# EAGLE design usbx-001 (EAGLE 9.6.2)
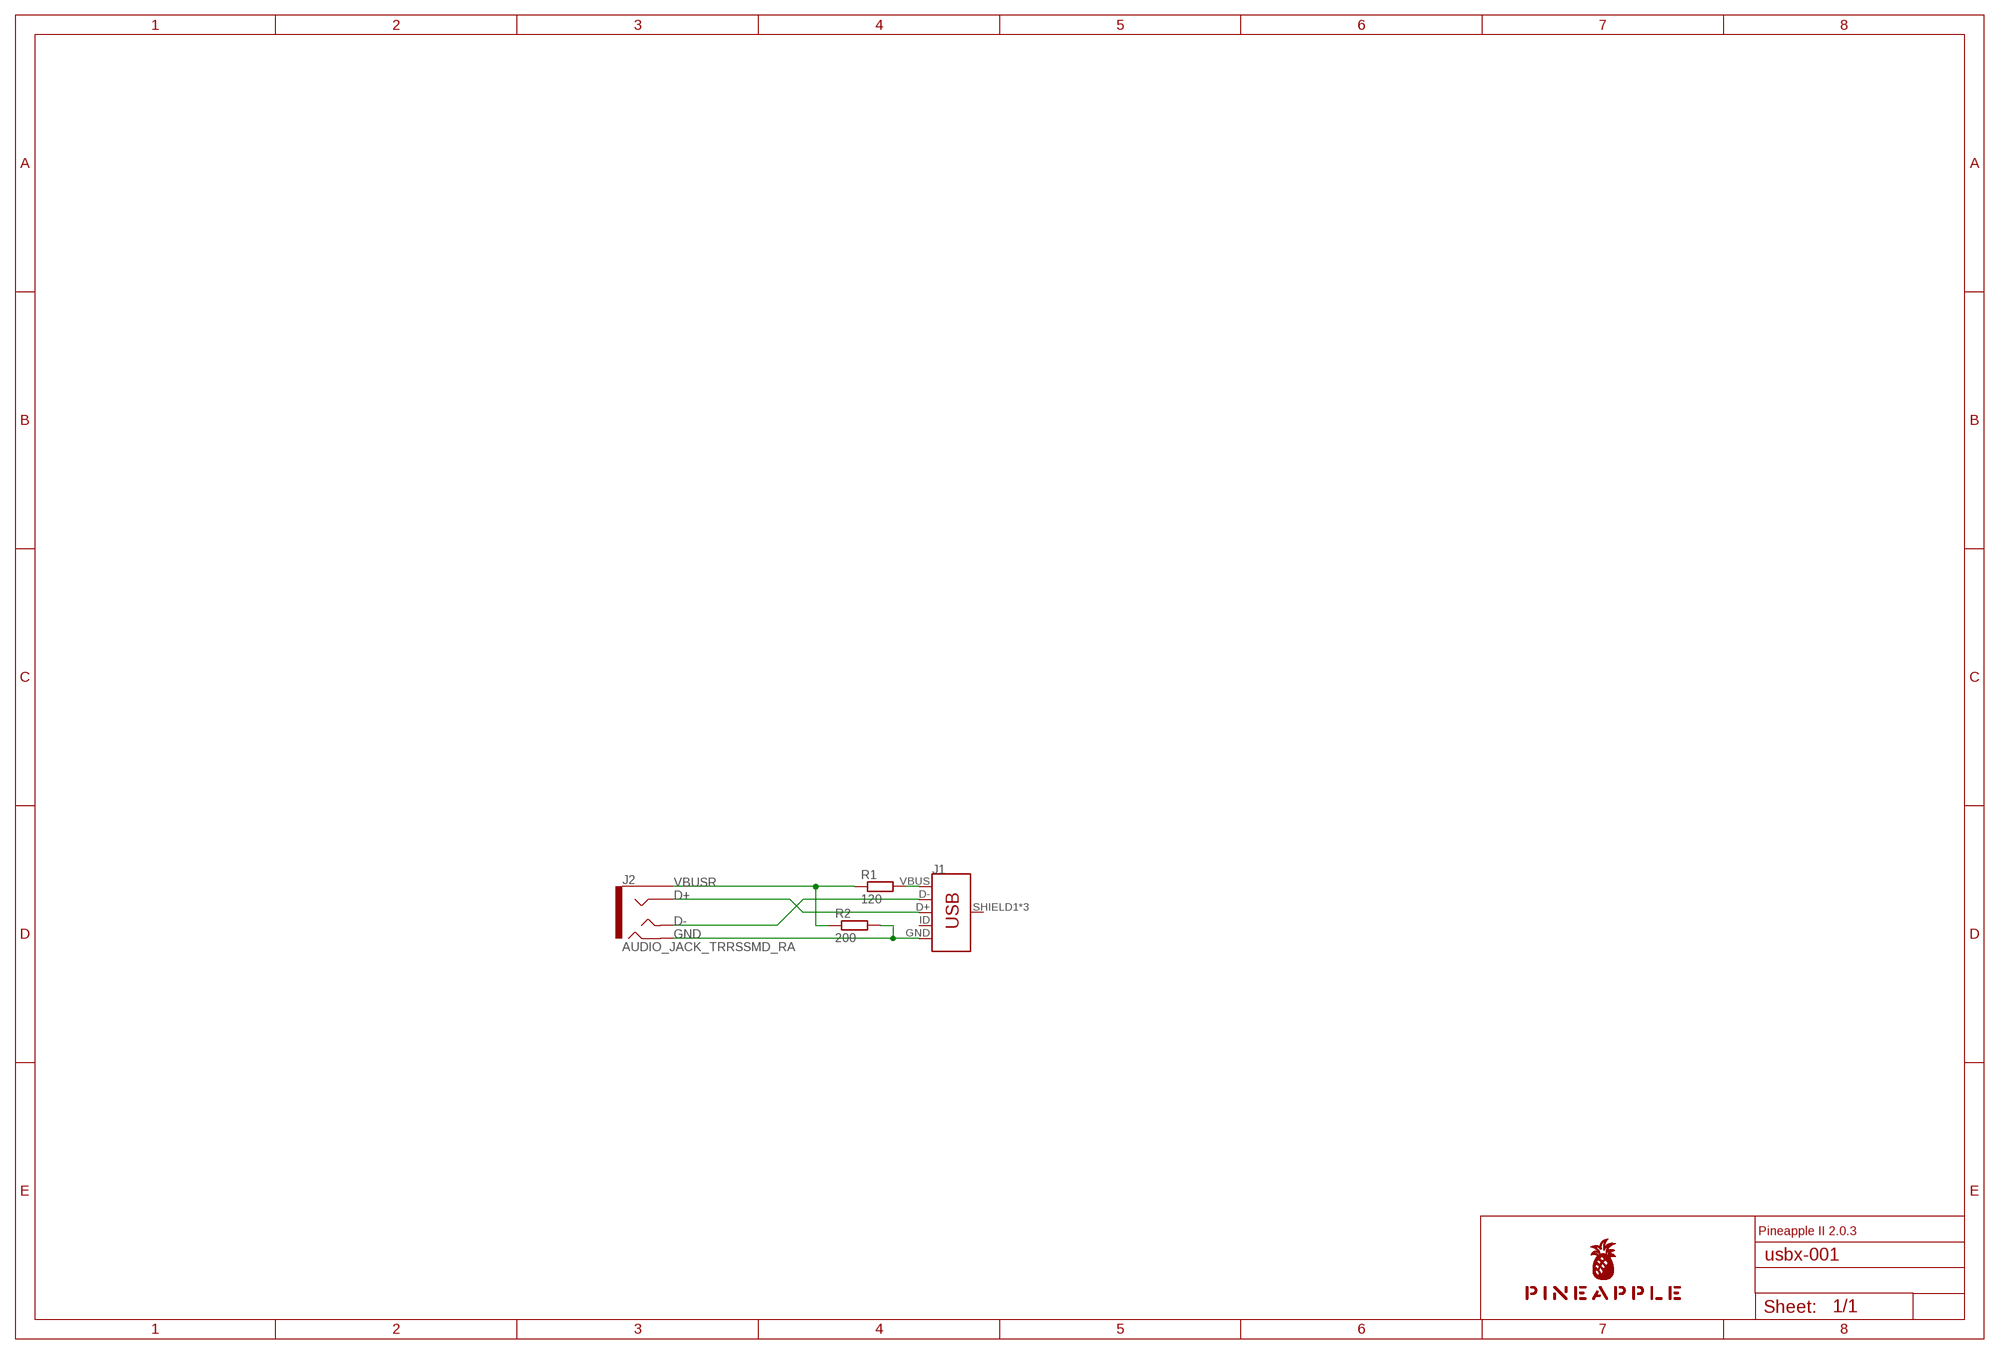
[diagram p0: schematic, sheet 1]

## Parts
J1  USB_MICRO-B_FEMALE-SMT  [USB-B-MICRO-SMD]
J2  AUDIO_JACK_TRRSSMD_RA  [AUDIO_JACK_3.5MM_TRRS_SMD_RA]
R1  120  R-EU_R2012  [R2012]
R2  200  R-EU_R2012  [R2012]
U$1  PINEAPPLE450_SILK  [PINEAPPLE450_SILK]

## Nets
D+: J1.D+ J2.RING1
D-: J1.D- J2.TIP
GND [gnd]: J1.GND J2.RING2 R2.2
VBUS [power]: J1.VBUS R1.2
VBUSR [power]: J2.EARTH R1.1 R2.1
Unconnected: J1.ID J1.SHIELD1(SHIELD) J1.SHIELD2(SHIELD) J1.SHIELD3(SHIELD)

## Notes on the sheet
- Pineapple II 2.0.3

## Library data of the parts
J1 = SparkFun-Connectors:USB_MICRO-B: USB Type Micro-B Connector Male/female and PTH/SMT variants SparkFun Products: SparkFun microB USB Breakout <https://www.sparkfun.com/products/12035> SparkFun USB microB Plug Breakout <https://www.sparkfun.com/products/10031> SparkFun ESP8266 Thing <https://www.sparkfun.com/products/13231>; PROD_ID: CONN-11752
J2 = SparkFun-Connectors:AUDIO_JACK_TRRS: Audio Jack - 3.5mm TRRS (SMD) This is a 3.5mm TRRS SMD audio jack. TRRS connectors are the audio-style connectors that you see on some phones, MP3 players and development boards. TRRS stands for “tip, ring, ring, sleeve,” which reflects that this has three conductors and a ground. SparkFun Products: Audio Jack <https://www.sparkfun.com/products/12639> mbed Starter Kit <https://www.sparkfun.com/products/12968> SparkFun TRRS 3.5mm Jack Breakout <https://www.sparkfun.com/products/11570>; PROD_ID: CONN-10676; SF_ID: PRT-12639
R1 R2 = rcl:R-EU_: RESISTOR, European symbol; SPICEPREFIX: R
U$1 = pineapple:PINEAPPLE450_SILK

## Net classes
0 default: width 0.152 mm, drill 0.152 mm, clearance 0.152 mm
1 gnd: width 0.305 mm, drill 0.152 mm, clearance 0.152 mm
2 power: width 0.305 mm, drill 0.152 mm, clearance 0.152 mm
3 analog: width 0.305 mm, drill 0.152 mm, clearance 0.152 mm
4 superpower: width 1.016 mm, drill 0.152 mm, clearance 0.152 mm

## Board
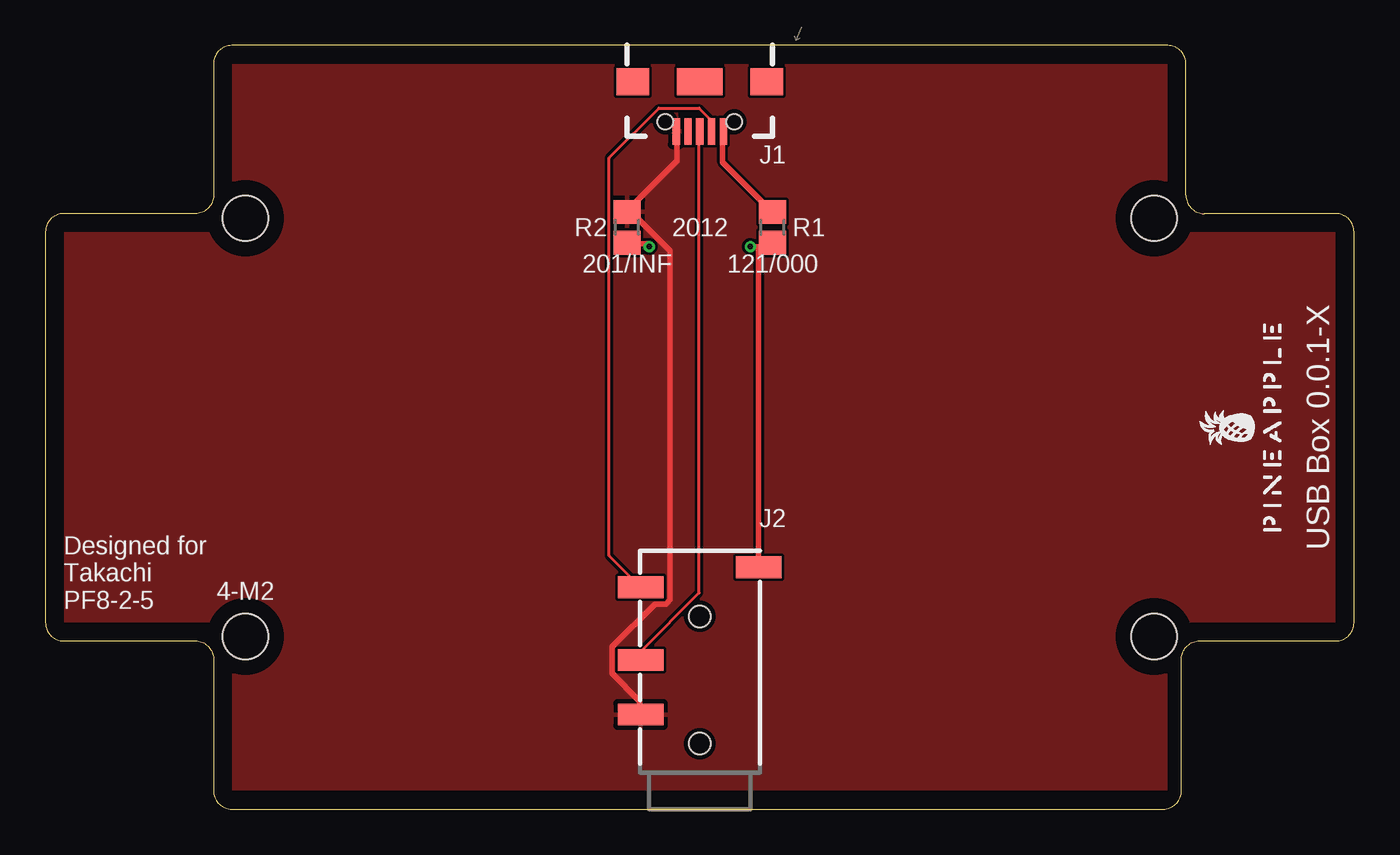
[diagram p1: board, top side]
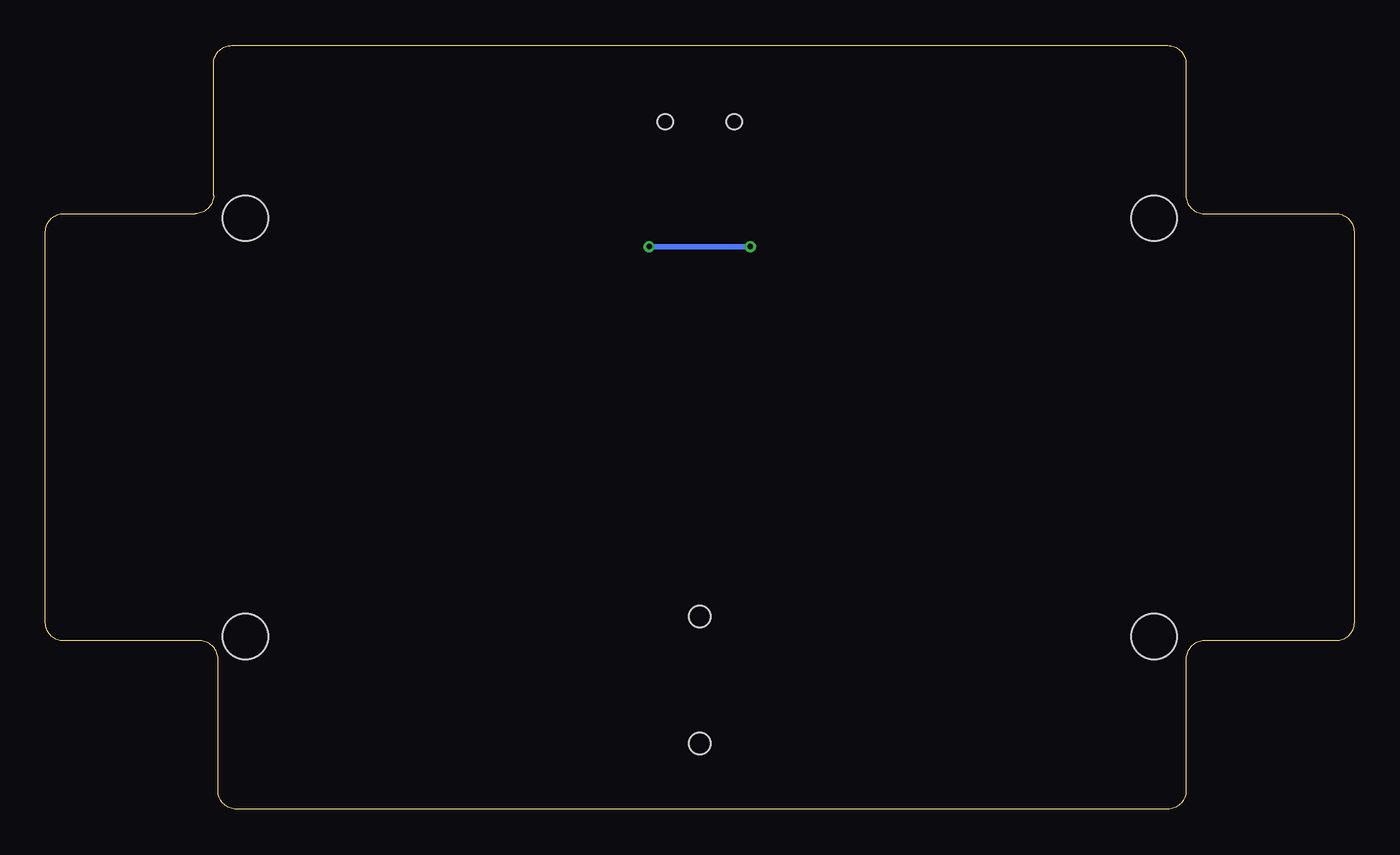
[diagram p2: board, bottom side, seen from below]

Size 72 x 42 mm. Coordinates in mm from the lower left corner, seen from the top.
Outline: 61.75,42 10.25,42 arc90 9.25,41 9.25,33.75 arc-90 8.25,32.75 1,32.75 arc90 0,31.75 0,10.25 arc90 1,9.25 8.25,9.25 arc-90 9.25,8.25 9.25,1 arc90 10.25,0 61.5,0 arc90 62.5,1 62.5,8.25 arc-90 63.5,9.25 71,9.25 arc90 72,10.25 72,31.75 arc90 71,32.75 63.75,32.75 arc-90 62.75,33.75 62.75,41 arc90 61.75,42
Copper layers (1*16): Top 0.035mm / dielectric 1.5mm / Bottom 0.035mm
Design rules "SeeedStudio_2layer_DRU_no_angle_20140221": minimum track width 6mil, minimum drill 12mil, track to track 6mil, track to pad 6mil, pad to pad 6mil, via to via 6mil, smd to smd 0mil, copper to edge 10mil, drill to drill 10mil, minimum pad ring 10mil, minimum via ring 6mil, stop-mask expansion 2mil, vias tented up to drill 100mil, thermal gap 10mil
Holes 2.5 mm at 61,32.5 11,32.5 11,9.5 61,9.5
tRestrict: area 9,30.5 to 13,34.5; area 59,30.5 to 63,34.5; area 9,7.5 to 13,11.5; area 59,7.5 to 63,11.5; area 0,41 to 72,42; area 71,0 to 72,42; area 0,0 to 72,1; area 0,0 to 1,42; area 0,31.8 to 9.2,32.8; area 9.2,32.8 to 10.2,42; area 61.8,32.8 to 62.8,42; area 62.8,31.8 to 72,32.8; 4 more areas
bRestrict: area 9,7.5 to 13,11.5; area 59,7.5 to 63,11.5; area 59,30.5 to 63,34.5; area 9,30.5 to 13,34.5; area 61.8,0 to 62.8,9.2; area 62.8,9.2 to 72,10.2; area 71,0 to 72,42; area 62.8,31.8 to 72,32.8; area 61.8,32.8 to 62.8,42; area 0,41 to 72,42; area 9.2,32.8 to 10.2,42; area 0,31.8 to 9.2,32.8; 4 more areas

### Footprints (pad centres in the part's own frame; a part is rotated, then mirrored left to right if it is on the bottom)
USB-B-MICRO-SMD = smd 1.45 x 0.4: D+ 2.725,0; D- 2.725,0.65; GND 2.725,-1.3; ID 2.725,-0.65; VBUS 2.725,1.3 | smd 1.5 x 1.8: SHIELD1 0,3.685; SHIELD2 0,-3.685 | smd 1.5 x 2.5: SHIELD3 0,0 | hole 0.85: 2.2,1.9; 2.2,-1.9
AUDIO_JACK_3.5MM_TRRS_SMD_RA = smd 1.2 x 2.5: EARTH 11.3,-3.25; RING1 6.2,3.25; RING2 3.2,3.25; TIP 10.2,3.25 | hole 1.2: 1.6,0; 8.6,0
R2012 = smd 1.3 x 1.5: 1 -0.85,0; 2 0.85,0

### Placement (x,y rotation side)
J1  36,40 270 top
J2  36,2 90 top
R1  40,32 90 top
R2  32,32 90 top
U$1  68,21 90 top

### Tracks (layer width: path | path; a pad name or v marks a point on that pad's centre or on a via)
D+
  Top 0.152: J1.D+ 35.97,37.26 35.97,11.89 32.77,8.69 32.77,8.23 J2.RING1
D-
  Top 0.152: J1.D- 36.58,37.34 36.58,37.95 35.97,38.56 33.76,38.56 31.01,35.81 31.01,13.95 32.69,12.27 J2.TIP
GND
  Top 0.305: J1.GND 34.75,37.26 34.75,35.66 32,32.92 R2.2 32.16,32.92 34.37,30.71 34.37,11.51 34.14,11.28 33.53,11.28 31.17,8.91 31.17,7.47 32.69,5.94 32.69,5.26 J2.RING2
  pour Top: -1,-1 73,-1 73,43 -1,43
VBUS
  Top 0.305: J1.VBUS 37.26,37.26 37.26,35.59 39.93,32.92 R1.2
VBUSR  (via drill 0.3)
  Top 0.305: v33.22,30.94 33.07,31.09 32,31.09 R2.1 | 39.24,30.94 39.78,30.94 39.93,31.09 R1.1 | 39.24,30.94 v38.79,30.94 | 39.24,30.94 39.24,13.34 J2.EARTH
  Bottom 0.305: v38.79,30.94 v33.22,30.94

### Text on the board
tNames: 2012 | 201/INF | 121/000 | USB Box 0.0.1-X | Designed for / Takachi / PF8-2-5 | 4-M2